# EAGLE design oven-controller (EAGLE 5.11)
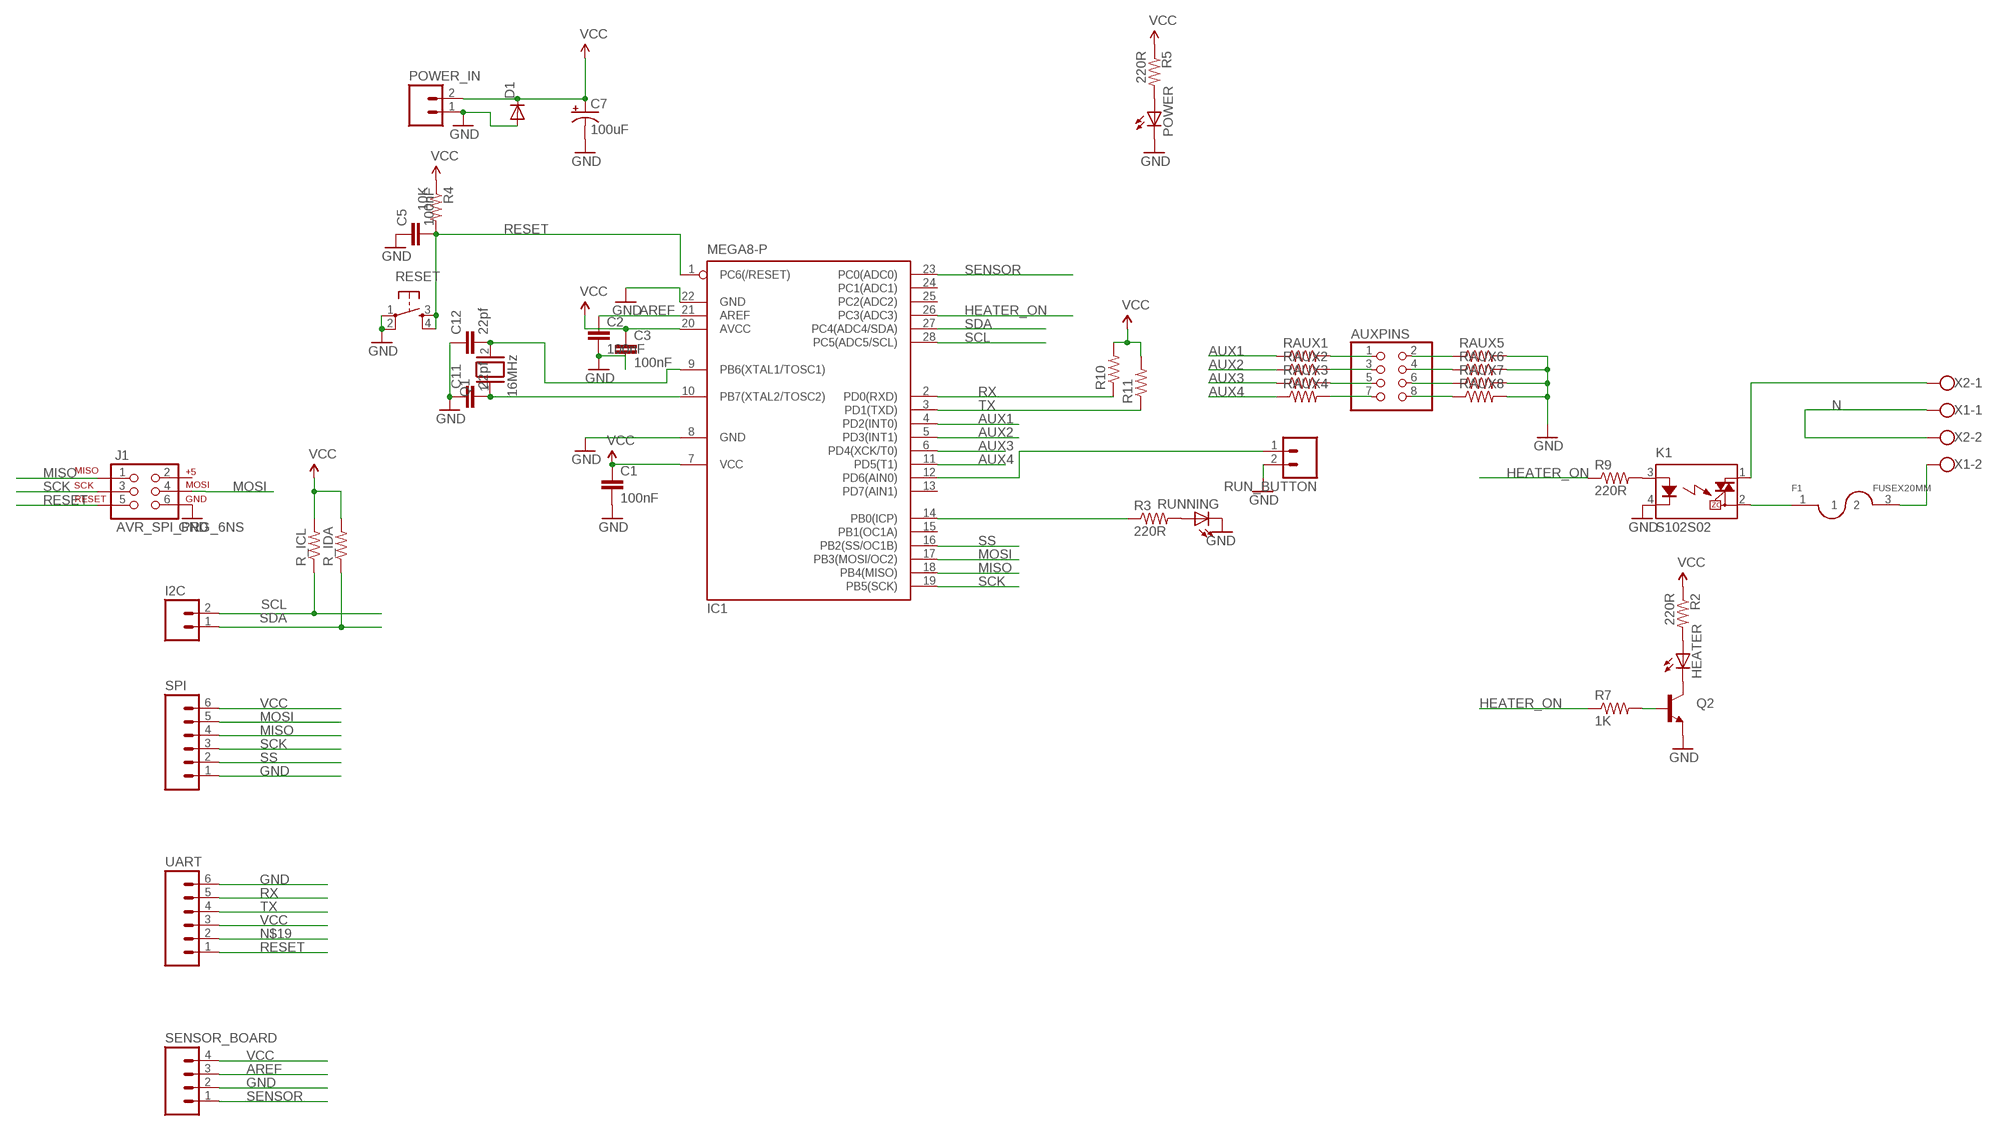
[diagram p0: schematic, sheet 1]

## Parts
AUXPINS  PINHD-2X4  [2X04]
C1  100nF  CAP0805  [0805]
C2  100nF  CAP0805  [0805]
C3  100nF  CAP0805  [0805]
C5  100nF  CAP0805  [0805]
C7  100uF  CAP_POLPTH1  [CPOL-RADIAL-100UF-25V]
C11  22pf  CAP0805  [0805]
C12  22pf  CAP0805  [0805]
D1  DIODESMA-KIT  [SMA-DIODE-KIT]
F1  FUSEX20MM  [FUSE_5MM]
HEATER  LED5MM  [LED5MM]
I2C  M02  [02P]
IC1  MEGA8-P  [DIL28-3]
J1  AVR_SPI_PRG_6NS  [2X3-NS]
K1  S102S02  [S202S02]
POWER  LED5MM  [LED5MM]
POWER_IN  M02LOCK_LONGPADS  [1X02_LOCK_LONGPADS]
Q1  16MHz  XTAL/S  [QS]
Q2  TRANSISTOR_NPNSOT23  [SOT23]
R2  220R  R-US_R0603  [R0603]
R3  220R  R-US_R0603  [R0603]
R4  10K  R-US_R0603  [R0603]
R5  220R  R-US_R0603  [R0603]
R7  1K  RESISTOR0805-RES  [0805]
R9  220R  RESISTOR0805-RES  [0805]
R10  R-US_R0603  [R0603]
R11  R-US_R0603  [R0603]
R_ICL  R-US_R0603  [R0603]
R_IDA  R-US_R0603  [R0603]
RAUX1  R-US_R0603  [R0603]
RAUX2  R-US_R0603  [R0603]
RAUX3  R-US_R0603  [R0603]
RAUX4  R-US_R0603  [R0603]
RAUX5  R-US_R0603  [R0603]
RAUX6  R-US_R0603  [R0603]
RAUX7  R-US_R0603  [R0603]
RAUX8  R-US_R0603  [R0603]
RESET  TAC_SWITCHPTH  [TACTILE-PTH]
RUN_BUTTON  M02  [02P]
RUNNING  LED5MM  [LED5MM]
SENSOR_BOARD  M04  [04P]
SPI  M06LONGPADS  [1X06_LONGPADS]
UART  M06LONGPADS  [1X06_LONGPADS]
X1  W237-102  [W237-102]
X2  W237-102  [W237-102]

## Nets
AREF: C2.1 IC1.21(AREF) SENSOR_BOARD.3
AUX1 [thick]: IC1.4(PD2(INT0)) RAUX1.1
AUX2 [thick]: IC1.5(PD3(INT1)) RAUX2.1
AUX3 [thick]: IC1.6(PD4(XCK/T0)) RAUX3.1
AUX4 [thick]: IC1.11(PD5(T1)) RAUX4.1
GND: C1.2 C2.2 C3.2 C5.1 C7.2(-) C11.1 C12.1 D1.A IC1.8(GND) IC1.22(GND) J1.6 K1.4(K) POWER.K(C) POWER_IN.1 Q2.2(E) RAUX5.2 RAUX6.2 RAUX7.2 RAUX8.2 RESET.1 RESET.2 RUN_BUTTON.2 RUNNING.K(C) SENSOR_BOARD.2 SPI.1 UART.6
HEATER_ON: IC1.26(PC3(ADC3)) R7.1 R9.1
MISO: IC1.18(PB4(MISO)) J1.1 SPI.4
MOSI: IC1.17(PB3(MOSI/OC2)) J1.4 SPI.5
N: X1.1 X2.2
N$1: POWER.A R5.2
N$2: Q2.1(B) R7.2
N$3 [thick]: AUXPINS.1 RAUX1.2
N$4: C11.2 IC1.10(PB7(XTAL2/TOSC2)) Q1.1
N$5: C12.2 IC1.9(PB6(XTAL1/TOSC1)) Q1.2
N$6: HEATER.K(C) Q2.3(C)
N$7 [thick]: AUXPINS.3 RAUX2.2
N$8: HEATER.A R2.2
N$9: R3.2 RUNNING.A
N$10 [thick]: AUXPINS.5 RAUX3.2
N$11 [thick]: AUXPINS.7 RAUX4.2
N$12: IC1.14(PB0(ICP)) R3.1
N$13 [thick]: AUXPINS.2 RAUX5.1
N$14: IC1.12(PD6(AIN0)) RUN_BUTTON.1
N$15: K1.3(A) R9.2
N$16: K1.1(DS1) X2.1
N$17 [thick]: AUXPINS.4 RAUX6.1
N$18: F1.3 X1.2
N$19: UART.2
N$20 [thick]: AUXPINS.6 RAUX7.1
N$21 [thick]: AUXPINS.8 RAUX8.1
N$22: F1.1 K1.2(DS2)
RESET: C5.2 IC1.1(PC6(/RESET)) J1.5 R4.2 RESET.3 RESET.4 UART.1
RX: IC1.2(PD0(RXD)) R10.1 UART.5
SCK: IC1.19(PB5(SCK)) J1.3 SPI.3
SCL: I2C.2 IC1.28(PC5(ADC5/SCL)) R_ICL.1
SDA: I2C.1 IC1.27(PC4(ADC4/SDA)) R_IDA.1
SENSOR: IC1.23(PC0(ADC0)) SENSOR_BOARD.1
SS: IC1.16(PB2(SS/OC1B)) SPI.2
TX: IC1.3(PD1(TXD)) R11.1 UART.4
VCC: C1.1 C3.1 C7.1(+) D1.C IC1.20(AVCC) POWER_IN.2 R2.1 R4.1 R5.1 R10.2 R11.2 R_ICL.2 R_IDA.2 SENSOR_BOARD.4 SPI.6 UART.3
Unconnected: IC1.13(PD7(AIN1)) IC1.15(PB1(OC1A)) IC1.24(PC1(ADC1)) IC1.25(PC2(ADC2)) J1.2

## Power pins joined to a net without a drawn wire
VCC: IC1.7(VCC)

## Library data of the parts
AUXPINS = pinhead:PINHD-2X4: PIN HEADER
C1-C3 C5 C11 C12 = SparkFun:CAP: Capacitor Standard 0603 ceramic capacitor, and 0.1" leaded capacitor.
C7 = SparkFun:CAP_POL: Capacitor Polarized These are standard SMD and PTH capacitors. Normally 10uF, 47uF, and 100uF in electrolytic and tantalum varieties. Always verify the external diameter of the through hole cap, it varies with capacity, voltage, and manufacturer. The EIA devices should be standard.
D1 = SparkFun:DIODE: Diode These are standard reverse protection diodes and small signal diodes. SMA package can handle up to about 1A. SOD-323 can handle about 200mA. What the SOD-323 package when ordering, there are some mfgs out there that are 5-pin packages.
F1 = SparkFun:FUSE
HEATER POWER RUNNING = SparkFun:LED: LEDs Standard schematic elements and footprints for 5mm, 3mm, 1206, and 0603 sized LEDs. 5mm - Spark Fun Electronics SKU : COM-00529 (and others)
I2C RUN_BUTTON = con-amp-quick:M02: AMP QUICK CONNECTOR; OC_FARNELL: unknown; OC_NEWARK: unknown
IC1 = atmel:MEGA8-P: MICROCONTROLLER 8 Kbytes FLASH, 1 kbytes SRAM, 512 bytes EEPROM, USART, 4-channel 10 bit ADC, 2-channel 8 bit ADC Pin compatible with Atmega48, ATMega88, ATMega168 Source: avr.lbr; OC_FARNELL: unknown; OC_NEWARK: unknown
J1 = SparkFun:AVR_SPI_PRG_6: AVR ISP 6 Pin This is the reduced ISP connector for AVR programming. Common on Arduino. This footprint will take up less PCB space and can be used with a 10-pin to 6-pin adapter such as SKU: BOB-08508
K1 = relay:S*02S02: IT(rms) 8A, Zero Cross type SIP 4pin Triac output SSR Source: http://sharp-world.com/products/device/lineup/data/pdf/datasheet/s102s02_e.pdf; OC_FARNELL: unknown; OC_NEWARK: unknown
POWER_IN = SparkFun:M02: Header 2 Standard 2-pin 0.1" header. Use with straight break away headers (SKU : PRT-00116), right angle break away headers (PRT-00553), swiss pins (PRT-00743), machine pins (PRT-00117), and female headers (PRT-00115). Molex polarized connector foot print use with SKU : PRT-08233 with associated crimp pins and housings.
Q1 = special:XTAL/S: CRYSTAL
Q2 = SparkFun:TRANSISTOR_NPN: Transistor NPN BJT configuration in SOT23 package. MMBT2222 is the common NPN we use. Double check BCE configuration again layout.
R2-R5 R10 R11 R_ICL R_IDA RAUX1-RAUX8 = adafruit:R-US_: RESISTOR, American symbol
R7 R9 = SparkFun:RESISTOR: Resistor Basic schematic elements and footprints for 0603, 1206, and PTH resistors.
RESET = SparkFun:TAC_SWITCH: Momentary Switch Button commonly used for reset or general input. Spark Fun Electronics SKU : COM-00097
SENSOR_BOARD = con-amp-quick:M04: AMP QUICK CONNECTOR; OC_FARNELL: unknown; OC_NEWARK: unknown
SPI UART = SparkFun:M06: Header 6 Standard 6-pin 0.1" header. Use with straight break away headers (SKU : PRT-00116), right angle break away headers (PRT-00553), swiss pins (PRT-00743), machine pins (PRT-00117), and female headers (PRT-00115). Molex polarized connector foot print use with SKU : PRT-08094 with associated crimp pins and housings. NOTES ON THE VARIANTS LOCK and LOCK_LONGPADS... This footprint was designed to help hold the alignment of a through-hole component (i.e. 6-pin header) while soldering it into place. You may notice that each hole has been shifted either up or down by 0.005 of an inch from it's more standard position (which is a perfectly straight line). This slight alteration caused the pins (the squares in the middle) to touch the edges of the holes. Because they are alternating, it causes a "brace" to hold the component in place. 0.005 has proven to be the perfect amount of "off-center" position when using our standard breakaway headers. Although looks a little odd when you look at the bare footprint, once you have a header in there, the alteration is very hard to notice. Also, if you push a header all the way into place, it is covered up entirely on the bottom side. This idea of altering the position of holes to aid alignment will be further integrated into the Sparkfun Library for other footprints. It can help hold any component with 3 or more connection pins.
X1 X2 = con-wago-500:W237-102: WAGO SCREW CLAMP; MPN: 237-102; OC_FARNELL: unknown; OC_NEWARK: 70K9898

## Net classes
1 thick: width 0.8 mm, drill 0.127 mm, clearance 0.127 mm

## Board
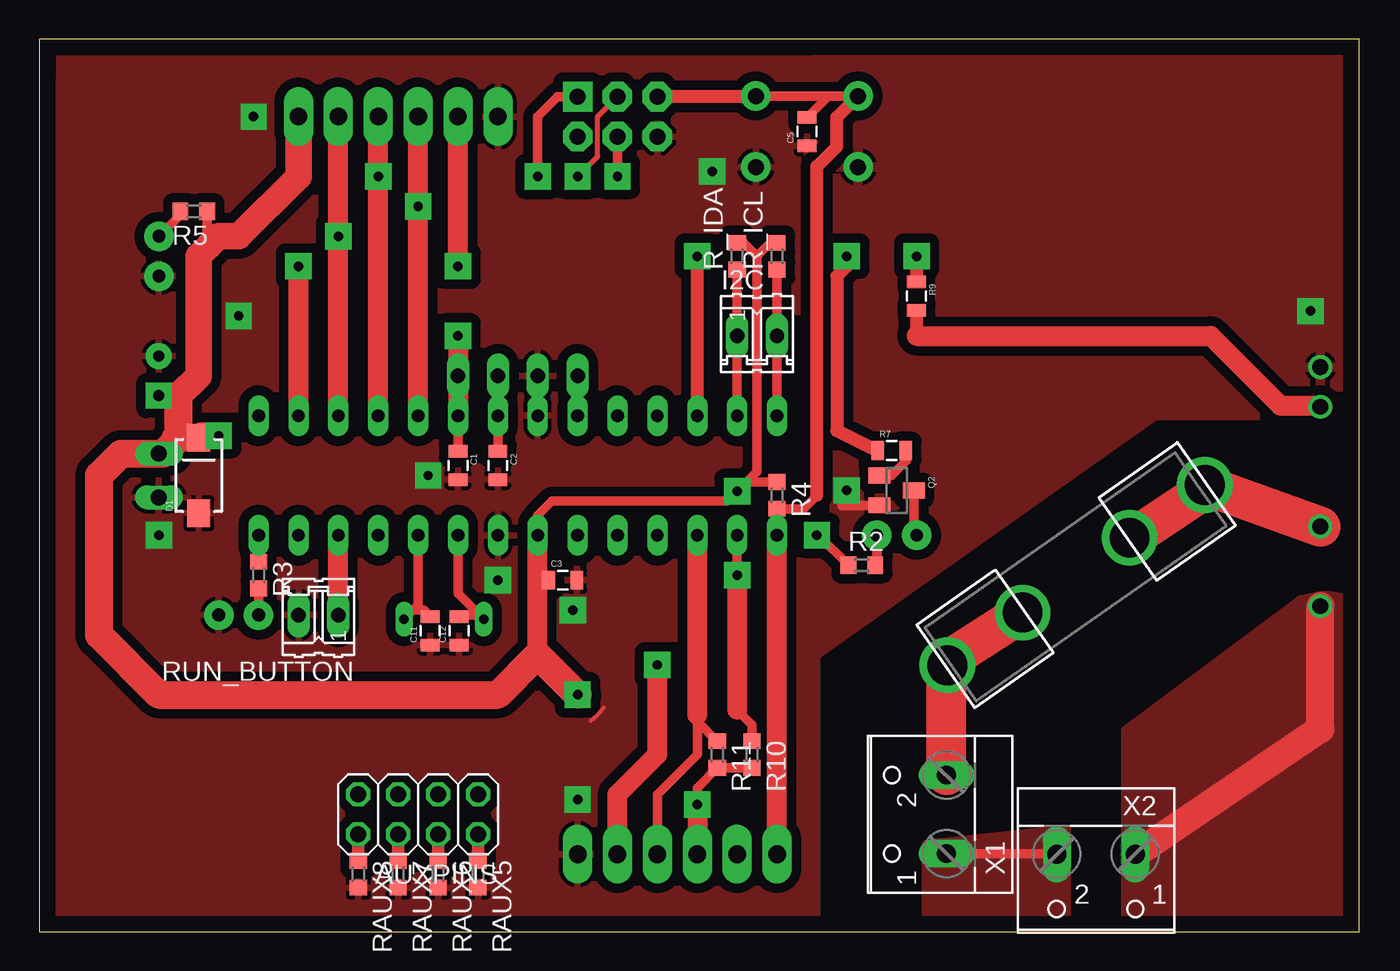
[diagram p1: board, top side]
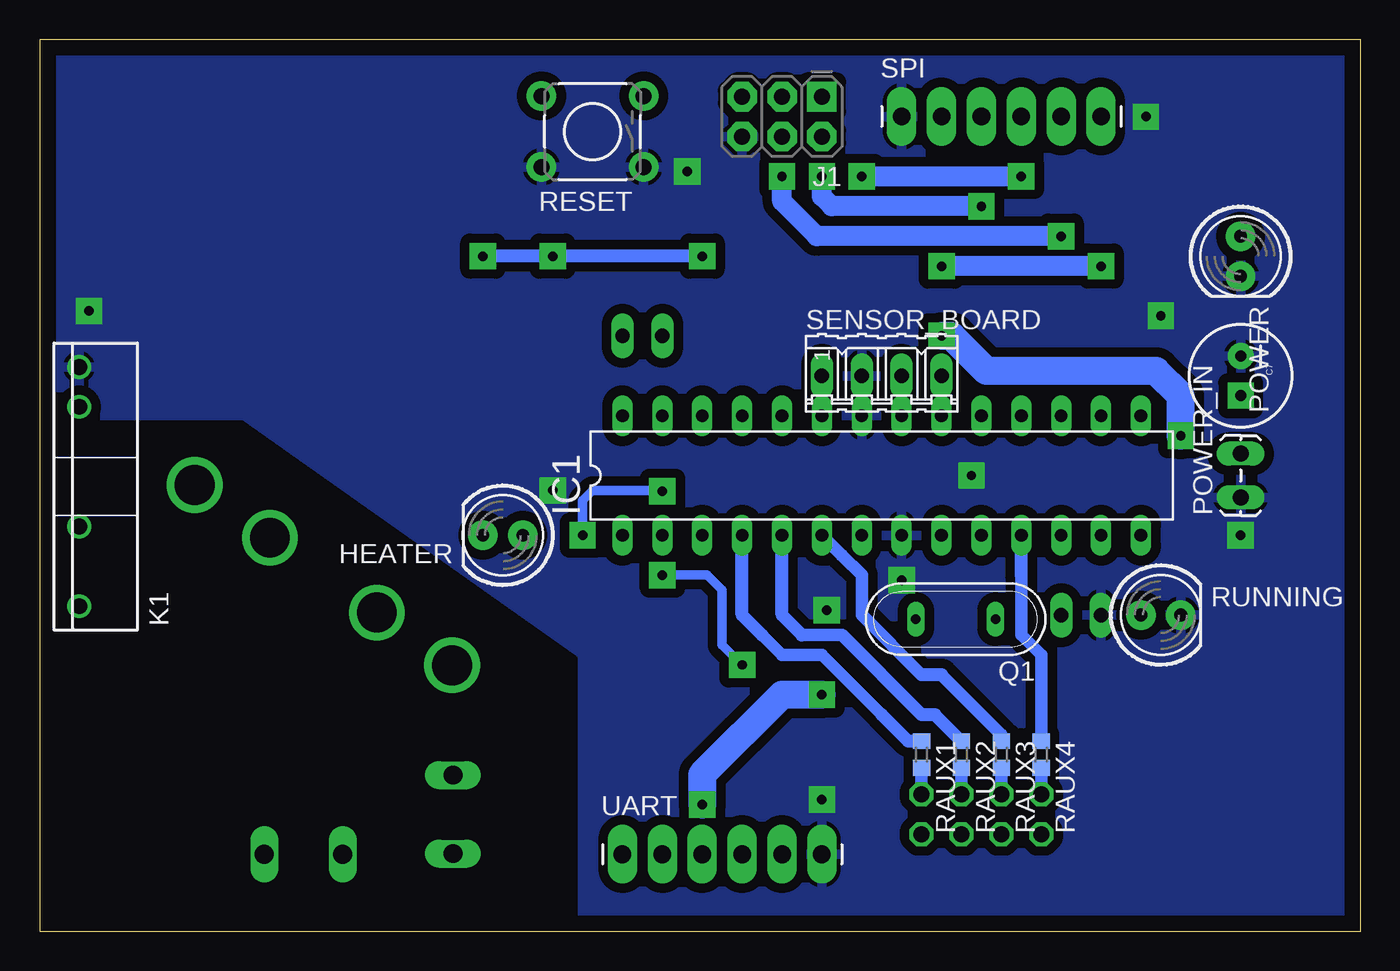
[diagram p2: board, bottom side, seen from below]

Size 84.06 x 56.85 mm. Coordinates in mm from the lower left corner, seen from the top.
Outline: 0,56.85 0,0 84.06,0 84.06,56.85 0,56.85
Copper layers (1*16): Top 0.035mm / dielectric 1.5mm / Bottom 0.035mm
Design rules "default": minimum track width 10mil, minimum drill 24mil, track to track 8mil, track to pad 8mil, pad to pad 8mil, via to via 8mil, smd to smd 8mil, copper to edge 40mil, drill to drill 8mil, minimum pad ring 10mil, minimum via ring 8mil, stop-mask expansion 4mil, vias tented up to drill 0mil, thermal gap 10mil

### Footprints (pad centres in the part's own frame; a part is rotated, then mirrored left to right if it is on the bottom)
2X04 = drill 1.016 octagon: 1 -3.81,-1.27; 2 -3.81,1.27; 3 -1.27,-1.27; 4 -1.27,1.27; 5 1.27,-1.27; 6 1.27,1.27; 7 3.81,-1.27; 8 3.81,1.27
0805 = smd 0.8 x 1.2: 1 -0.9,0; 2 0.9,0
CPOL-RADIAL-100UF-25V = drill 0.7 pad 1.651 square: 1 1.27,0 | drill 0.7 pad 1.651 round: 2 -1.27,0
SMA-DIODE-KIT = smd 1.77 x 1.47: A -2.4,0; C 2.4,0
FUSE_5MM = drill 2.54 pad 3.556 round: 1 0,-10; 2 0,-4.158; 3 0,4.158; 4 0,10
LED5MM = drill 0.813 pad 1.88 round: A -1.27,0; K 1.27,0
02P = drill 0.914 long: 1 -1.27,0; 2 1.27,0
DIL28-3 = drill 0.813 long: 1 -16.51,-3.81; 2 -13.97,-3.81; 3 -11.43,-3.81; 4 -8.89,-3.81; 5 -6.35,-3.81; 6 -3.81,-3.81; 7 -1.27,-3.81; 8 1.27,-3.81; 9 3.81,-3.81; 10 6.35,-3.81; 11 8.89,-3.81; 12 11.43,-3.81; 13 13.97,-3.81; 14 16.51,-3.81; 15 16.51,3.81; 16 13.97,3.81; 17 11.43,3.81; 18 8.89,3.81; 19 6.35,3.81; 20 3.81,3.81; 21 1.27,3.81; 22 -1.27,3.81; 23 -3.81,3.81; 24 -6.35,3.81; 25 -8.89,3.81; 26 -11.43,3.81; 27 -13.97,3.81; 28 -16.51,3.81
2X3-NS = drill 1.016 pad 1.88 square: 1 -2.54,-1.27 | drill 1.016 pad 1.88 octagon: 2 -2.54,1.27; 3 0,-1.27; 4 0,1.27; 5 2.54,-1.27; 6 2.54,1.27
S202S02 = drill 1 round: 1 -7.62,0; 2 -2.54,0; 3 5.08,0; 4 7.62,0
1X02_LOCK_LONGPADS = drill 1.016 long: 1 -0.127,0; 2 2.667,0
QS = drill 0.61 long: 1 -2.54,0; 2 2.54,0
SOT23 = smd 1 x 1.4: 1 -0.95,-1.1; 2 0.95,-1.1; 3 0,1.1
R0603 = smd 1 x 1.1: 1 -0.85,0; 2 0.85,0
TACTILE-PTH = drill 1.016 pad 1.88 round: 1 -3.251,2.261; 2 3.251,2.261; 3 -3.251,-2.261; 4 3.251,-2.261
04P = drill 0.914 long: 1 -3.81,0; 2 -1.27,0; 3 1.27,0; 4 3.81,0
1X06_LONGPADS = drill 1.118 pad 1.88 long: 1 0,0; 2 2.54,0; 3 5.08,0; 4 7.62,0; 5 10.16,0; 6 12.7,0
W237-102 = drill 1.194 long: 1 -2.5,-1.27; 2 2.5,-1.27

### Placement (x,y rotation side)
AUXPINS  24.13,7.47 180 top
C1  26.67,29.7 270 top
C2  29.21,29.7 270 top
C3  33.34,22.39 0 top
C5  48.9,50.97 90 top
C7  7.62,35.41 270 bottom
C11  24.9,19.16 90 top
C12  26.75,19.16 90 top
D1  10.16,29.06 90 top
F1  66.04,22.71 125 top
HEATER  54.61,25.25 180 bottom
I2C  45.72,37.95 0 top
IC1  30.48,29.06 0 bottom
J1  36.83,51.92 180 bottom
K1  81.6,28.35 90 bottom
POWER  7.62,43.03 270 bottom
POWER_IN  7.62,27.79 90 bottom
Q1  25.77,19.91 180 bottom
Q2  54.61,28.11 270 top
R2  52.39,23.35 0 top
R3  13.97,22.71 270 top
R4  46.99,27.79 270 top
R5  9.84,45.89 180 top
R7  54.29,30.65 0 top
R9  55.88,40.49 270 top
R10  45.4,11.28 270 top
R11  43.18,11.28 270 top
R_ICL  46.99,43.03 90 top
R_IDA  44.45,43.03 90 top
RAUX1  27.94,11.28 270 bottom
RAUX2  25.4,11.28 270 bottom
RAUX3  22.86,11.28 270 bottom
RAUX4  20.32,11.28 270 bottom
RAUX5  27.94,3.66 270 top
RAUX6  25.4,3.66 270 top
RAUX7  22.86,3.66 270 top
RAUX8  20.32,3.66 270 top
RESET  48.9,50.97 180 bottom
RUN_BUTTON  17.78,20.17 180 top
RUNNING  12.7,20.17 0 bottom
SENSOR_BOARD  30.48,35.41 0 bottom
SPI  29.21,51.92 0 bottom
UART  46.99,4.93 0 bottom
X1  56.52,7.47 90 top
X2  67.31,3.66 180 top

### Tracks (layer width: path | path; a pad name or v marks a point on that pad's centre or on a via)
AREF
  Top 0.61: C2.1 IC1.21
  Top 0.813: IC1.21 SENSOR_BOARD.3
AUX1
  Bottom 0.8: 30.48,13.82 34.29,17.63 36.83,17.63 38.1,18.9
  Bottom 0.813: 38.1,18.9 39.37,20.17 IC1.4 | 30.48,13.82 28.79,12.13 RAUX1.1
AUX2
  Bottom 0.8: 33.02,18.9 35.56,18.9
  Bottom 0.813: 35.56,18.9 36.83,20.17 IC1.5 | 33.02,18.9 27.94,13.82 27.09,13.82 RAUX2.1
AUX3
  Bottom 0.8: 33.02,23.98 31.75,22.71 31.75,20.17 27.94,16.36
  Bottom 0.813: 33.02,23.98 IC1.6 | 27.94,16.36 26.67,16.36 22.86,12.55 RAUX3.1
AUX4
  Bottom 0.8: 21.59,22.71 21.59,18.9 20.32,17.63 RAUX4.1
  Bottom 0.813: 21.59,22.71 IC1.11
GND  (via drill 0.6 pad 1.68)
  Top 0.254: 35.94,14.26 35.56,13.82 35.12,13.44
  Top 0.61: 51.12,27.16 Q2.2
  other vias: 24.77,29.06 33.97,20.49 29.21,22.39 7.62,25.25 34.29,8.42 13.65,51.92 51.44,28.11 12.7,39.22 42.86,48.43 80.96,39.54
  pour Top (isolate 0.61): 49.53,55.73 49.53,1.12 0.64,1.12 1.27,55.73
  pour Top (isolate 0.61): 83.82,32.87 71.12,32.87 49.53,17.63 49.53,57 83.82,57
  pour Bottom (isolate 0.61): 0,57 83.82,57 83.82,32.87 71.12,32.87 49.53,17.63 49.53,-0.15 0,-0.15
HEATER_ON  (via drill 0.6 pad 1.68)
  Top 0.813: IC1.26 v41.91,43.03 | v55.88,43.03 R9.1 | R7.1 53.34,30.65 50.8,31.92 50.8,41.76 51.44,42.4 v51.44,43.03
  Bottom 0.813: v41.91,43.03 v51.44,43.03 v55.88,43.03
MISO  (via drill 0.6 pad 1.68)
  Top 0.61: J1.1 33.02,53.19 31.75,51.92 v31.75,48.11
  Top 1.27: IC1.18 v21.59,48.11 SPI.4
  Bottom 1.27: v21.59,48.11 v31.75,48.11
MOSI  (via drill 0.6 pad 1.68)
  Top 0.61: v36.83,48.11 J1.4
  Top 1.27: IC1.17 v19.05,44.3 SPI.5
  Bottom 1.27: v36.83,48.11 36.83,46.52 34.61,44.3 v19.05,44.3
N
  Top 0.61: X1.1 64.77,4.97 X2.2
  pour Top (no thermals): 56.52,5.56 65.41,6.52 65.41,0.17 56.52,0.17
N$1
  Top 0.61: R5.2 8.99,45.67 POWER.A
N$2
  Top 0.61: Q2.1 54.29,29.06 55.24,30.01 55.24,30.6 R7.2
N$3
  Bottom 0.8: AUXPINS.1 RAUX1.2
N$4
  Top 0.61: 23.81,20.49 Q1.1 | 23.81,20.49 24.13,20.8 IC1.10 | C11.2 24.47,20.49 23.81,20.49
N$5
  Top 0.61: IC1.9 26.67,21.55 Q1.2 28.2,19.91 27.94,20.17 26.85,20.17 C12.2
N$6
  Top 0.61: HEATER.K 55.71,25.42 Q2.3
N$7
  Bottom 0.8: AUXPINS.3 RAUX2.2
N$8
  Top 0.61: HEATER.A 53.34,23.77 R2.2
N$9
  Top 0.61: RUNNING.A R3.2
N$10
  Bottom 0.8: AUXPINS.5 RAUX3.2
N$11
  Bottom 0.8: AUXPINS.7 RAUX4.2
N$12
  Top 0.61: R3.1 IC1.14
N$13
  Top 0.8: RAUX5.1 AUXPINS.2
N$14
  Top 1.27: RUN_BUTTON.1 IC1.12
N$15
  Top 0.61: 81.52,33.51 K1.3
  Top 0.813: R9.2 55.88,37.95
  Top 1.27: 55.88,37.95 74.61,37.95 79.06,33.51 81.52,33.51
N$16
  Top 1.778: K1.1 81.6,12.91 X2.1
  pour Top (no thermals): 81.92,21.44 80.33,21.12 69.22,12.87 69.22,0.17 83.82,0.17 83.82,21.12
N$17
  Top 0.8: RAUX6.1 AUXPINS.4
N$18
  Top 2.54: X1.2 57.78,17 58.42,17.63 F1.3
N$20
  Top 0.8: RAUX7.1 AUXPINS.6
N$21
  Top 0.8: RAUX8.1 AUXPINS.8
N$22
  Top 2.54: F1.1 K1.2
N$23
  Top 2.54: 69.85,25.25 73.66,27.79
RESET
  Top 0.61: RESET.4 RESET.3 | C5.2 50.26,53.23 RESET.4 | RESET.4 52.07,53.3 | RESET.4 52.18,53.19 | IC1.1 R4.2 48.68,26.94 49.53,27.79
  Top 0.813: J1.5 45.61,53.19 RESET.3 | 49.53,27.79 49.53,48.75 50.8,50.02 50.8,51.88 RESET.4
  Top 1.27: UART.1 IC1.1
RX  (via drill 0.6 pad 1.68)
  Top 0.61: v44.45,22.71 IC1.2 | 44.45,14.14 45.4,13.19 R10.1
  Top 1.27: v39.37,17 39.37,11.28 36.83,8.74 UART.5 | v44.45,22.71 44.45,14.14
  Bottom 0.61: v44.45,22.71 41.59,22.71 40.64,21.76 40.64,18.27 v39.37,17
SCK  (via drill 0.6 pad 1.68)
  Top 0.305: J1.3 35.56,51.92 35.56,49.38 v34.29,48.11
  Top 1.27: IC1.19 v24.13,46.2 SPI.3
  Bottom 1.27: v34.29,48.11 34.29,46.84 33.66,46.2 v24.13,46.2
SCL
  Top 0.61: R_ICL.1 I2C.2 IC1.28
SDA
  Top 0.61: R_IDA.1 I2C.1 IC1.27
SENSOR
  Top 0.813: IC1.23 SENSOR_BOARD.1
SS  (via drill 0.6 pad 1.68)
  Top 1.27: IC1.16 v16.51,42.4 | v26.67,42.4 SPI.2
  Bottom 1.27: v16.51,42.4 v26.67,42.4
TX
  Top 0.61: 41.91,13.4 41.91,11.28 39.37,8.74 UART.4 | 41.91,13.4 R11.1 | 41.91,13.4 41.91,13.82
  Top 1.27: 41.91,13.82 IC1.3
VCC  (via drill 0.6 pad 1.68)
  Top 0.61: IC1.20 C1.1 | D1.C 10.3,31.6 | IC1.7 31.75,26.52 32.65,27.42 43.81,27.42 v44.45,28.05 45.03,28.64 | 10.16,35.41 9.79,35.78 | 10.16,41.76 9.79,41.39 | C3.1 32.07,22.39 31.75,22.71 | 10.79,43.66 10.43,44.04 10.69,44.3 R5.1 | 45.03,28.64 R4.1 | v49.53,25.25 49.63,25.25 R2.1 | 45.03,28.64 45.72,29.33 45.72,43.03 | 45.72,43.03 44.87,43.88 R_IDA.2 | 45.72,43.03 46.57,43.88 R_ICL.2 | R10.2 R11.2 41.91,9.16 41.91,7.47
  Top 1.27: v26.67,37.95 SENSOR_BOARD.4 IC1.20 | 31.75,17.63 31.75,22.71 IC1.7 | v41.91,8.11 41.91,7.47 UART.3
  Top 1.676: 8.62,31.46 8.89,31.46 D1.C | C7.1 8.89,34.14 10.16,35.41 10.16,41.76 10.16,43.03 10.79,43.66 11.43,44.3 12.7,44.3 16.51,48.11 SPI.6 | 10.3,31.6 v11.43,31.6
  Top 1.778: 8.89,34.14 8.89,31.46 7.89,30.46 POWER_IN.2 5.21,30.46 3.81,29.06 3.81,18.9 7.62,15.09 29.21,15.09 31.75,17.63 v34.29,15.09
  Bottom 0.61: v49.53,25.25 49.53,27.47 48.9,28.11 44.82,28.11 v44.45,28.05
  Bottom 1.778: v34.29,15.09 36.83,15.09 41.91,10.01 v41.91,8.11 | v11.43,31.6 11.43,34.14 13.02,35.73 23.81,35.73 26.04,37.95 v26.67,37.95